# EAGLE design Thermostat_V1.0 (EAGLE 6.4)
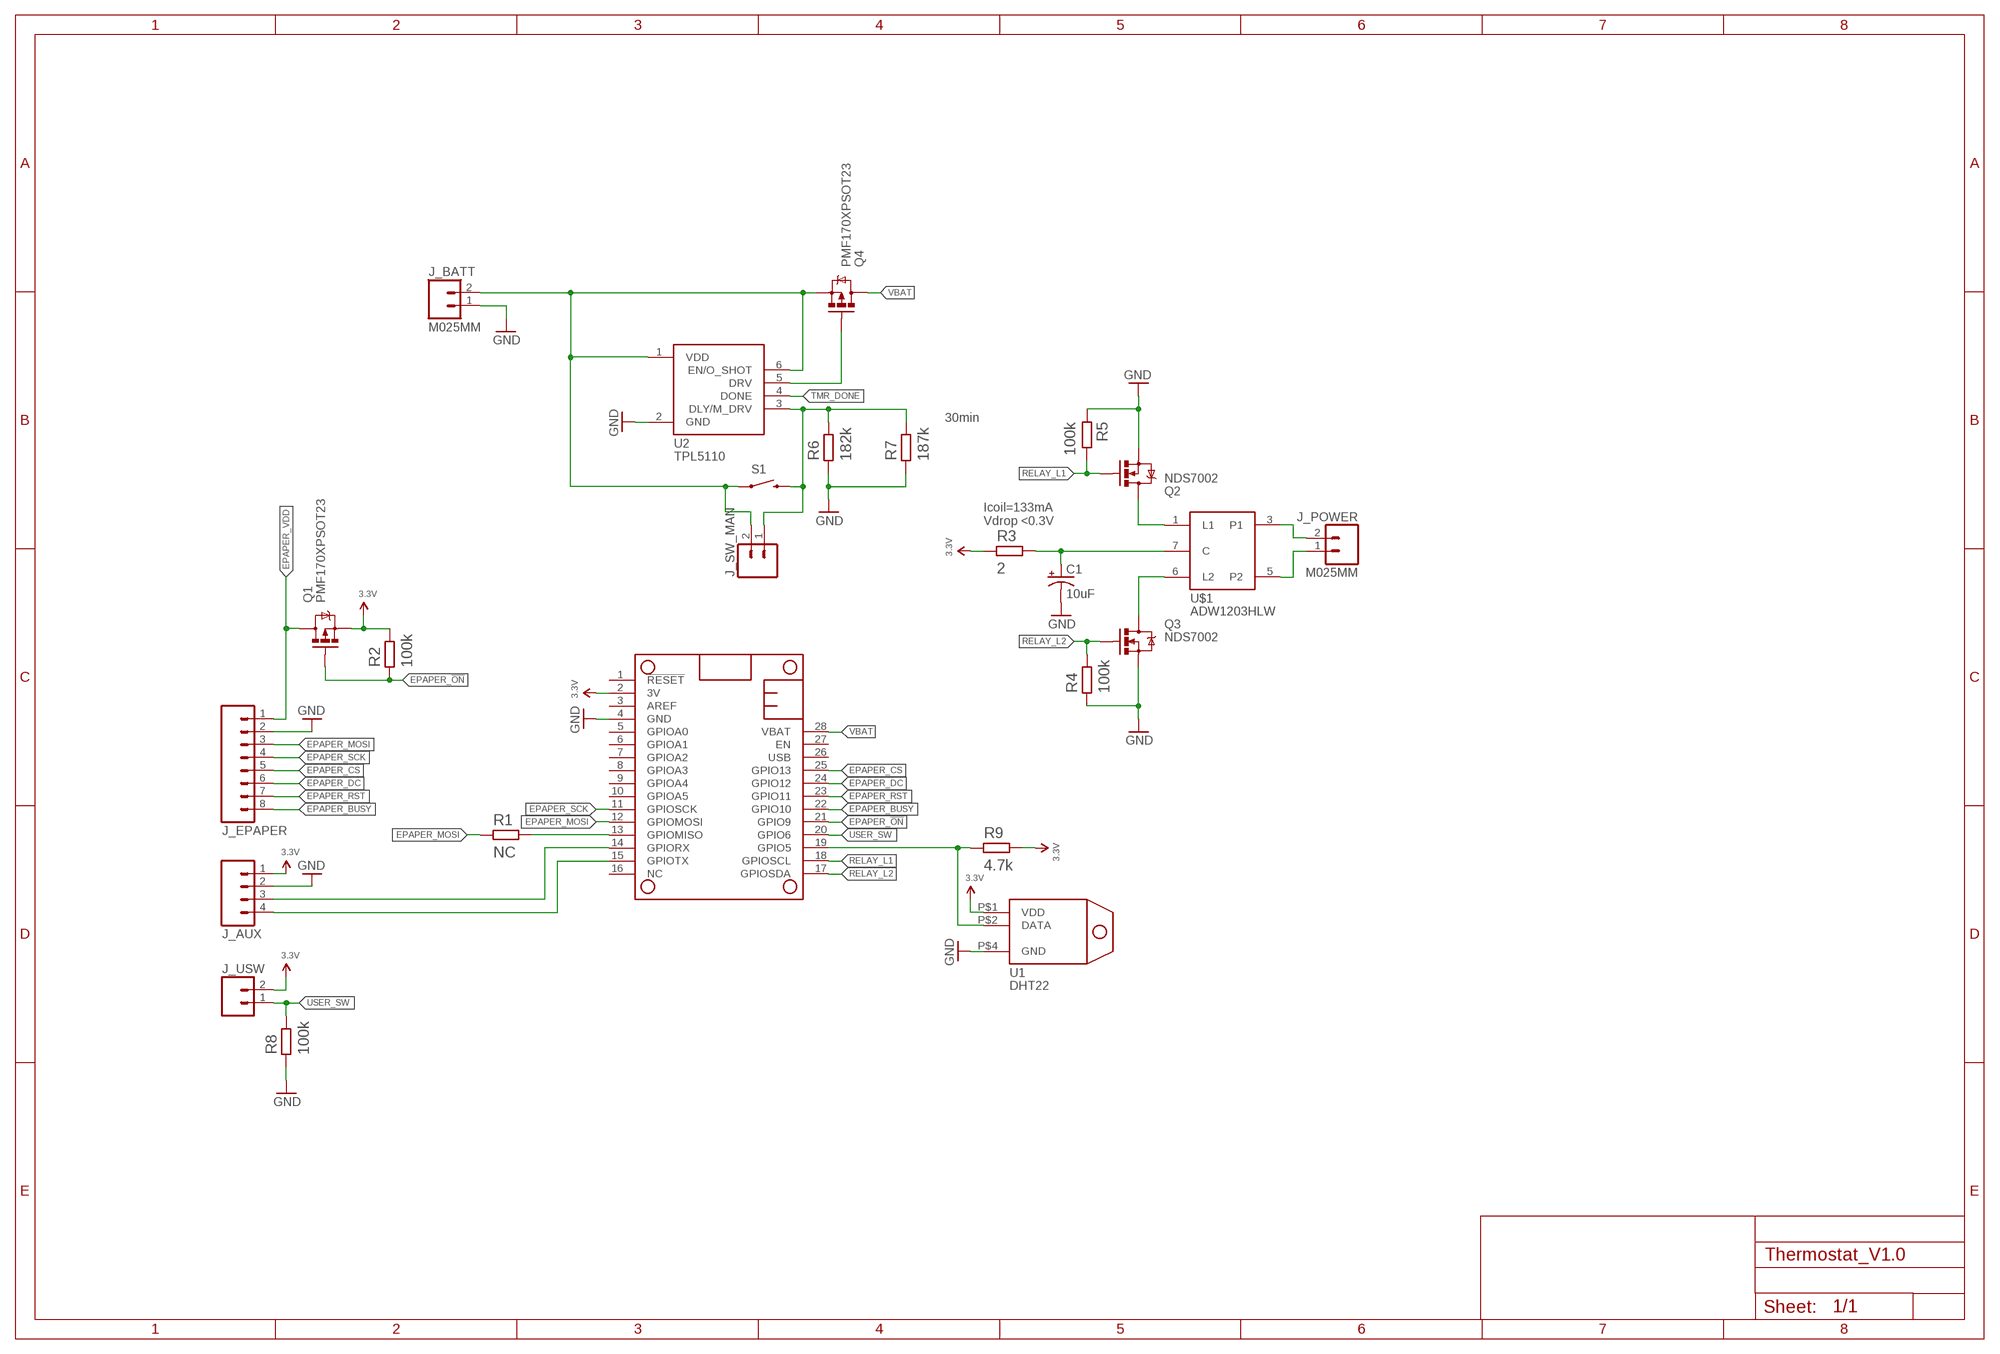
[diagram p0: schematic, sheet 1]

## Parts
C1  10uF  CAP_POLPTH1  [CPOL-RADIAL-100UF-25V]
J_AUX  M04LOCK  [1X04_LOCK]
J_BATT  M025MM  [SCREWTERMINAL-5MM-2]
J_EPAPER  M081X08  [1X08]
J_POWER  M025MM  [SCREWTERMINAL-5MM-2]
J_SW_MAN  M023.5MM-NO_SILK  [SCREWTERMINAL-3.5MM-2-NS]
J_USW  M023.5MM-NO_SILK  [SCREWTERMINAL-3.5MM-2-NS]
MS1  FEATHERWING  [FEATHERWING]
Q1  PMF170XPSOT23  [SOT23]
Q2  NDS7002  [SOT23]
Q3  NDS7002  [SOT23]
Q4  PMF170XPSOT23  [SOT23]
R1  NC  R0805  [R0805]
R2  100k  R0805  [R0805]
R3  2  R0805  [R0805]
R4  100k  R0805  [R0805]
R5  100k  R0805  [R0805]
R6  182k  R1210  [1210]
R7  187k  R1210  [1210]
R8  100k  R0805  [R0805]
R9  4.7k  R0805  [R0805]
S1  SWITCH-MOMENTARY-2SMD-4  [TACTILE_SWITCH_TALL]
U1  DHT22  [DHT22]
U2  TPL5110  [SOT23-6]
U$1  ADW1203HLW  [DW_RELAY]

## Nets
3.3V: J_AUX.1 J_USW.2 MS1.2(3V) Q1.2(S) R2.2 R3.1 R9.2 U1.P$1(VDD)
EPAPER_!ON: MS1.21(GPIO9) Q1.1(G) R2.1
EPAPER_BUSY: J_EPAPER.8 MS1.22(GPIO10)
EPAPER_CS: J_EPAPER.5 MS1.25(GPIO13)
EPAPER_DC: J_EPAPER.6 MS1.24(GPIO12)
EPAPER_MOSI: J_EPAPER.3 MS1.12(GPIOMOSI) R1.1
EPAPER_RST: J_EPAPER.7 MS1.23(GPIO11)
EPAPER_SCK: J_EPAPER.4 MS1.11(GPIOSCK)
EPAPER_VDD: J_EPAPER.1 Q1.3(D)
GND: C1.2(-) J_AUX.2 J_BATT.1 J_EPAPER.2 MS1.4(GND) Q2.2(S) Q3.2(S) R4.1 R5.1 R6.1 R7.1 R8.1 U1.P$4(GND) U2.2(GND)
N$1: J_POWER.2 U$1.3(P1)
N$2: J_POWER.1 U$1.5(P2)
N$3: MS1.19(GPIO5) R9.1 U1.P$2(DATA)
N$4: MS1.13(GPIOMISO) R1.2
N$5: C1.1(+) R3.2 U$1.7(C)
N$6: Q2.3(D) U$1.1(L1)
N$7: Q3.3(D) U$1.6(L2)
N$8: Q4.1(G) U2.5(DRV)
N$9: J_BATT.2 J_SW_MAN.2 Q4.2(S) S1.A2 U2.1(VDD) U2.6(EN/O_SHOT)
N$10: J_SW_MAN.1 R6.2 R7.2 S1.B2 U2.3(DLY/M_DRV)
N$11: J_AUX.3 MS1.14(GPIORX)
N$12: J_AUX.4 MS1.15(GPIOTX)
RELAY_L1: MS1.18(GPIOSCL) Q2.1(G) R5.2
RELAY_L2: MS1.17(GPIOSDA) Q3.1(G) R4.2
TMR_DONE: U2.4(DONE)
USER_SW: J_USW.1 MS1.20(GPIO6) R8.2
VBAT: MS1.28(VBAT) Q4.3(D)
Unconnected: MS1.1(!RESET) MS1.3(AREF) MS1.5(GPIOA0) MS1.6(GPIOA1) MS1.7(GPIOA2) MS1.8(GPIOA3) MS1.9(GPIOA4) MS1.10(GPIOA5) MS1.16(NC) MS1.26(USB) MS1.27(EN)

## Notes on the sheet
- 30min
- Icoil=133mA
  Vdrop <0.3V

## Library data of the parts
C1 = SparkFun-Capacitors:CAP_POL: Capacitor Polarized These are standard SMD and PTH capacitors. Normally 10uF, 47uF, and 100uF in electrolytic and tantalum varieties. Always verify the external diameter of the through hole cap, it varies with capacity, voltage, and manufacturer. The EIA devices should be standard.
J_AUX = 0SBLib:M04: Header 4 Standard 4-pin 0.1" header. Use with straight break away headers (SKU : PRT-00116), right angle break away headers (PRT-00553), swiss pins (PRT-00743), machine pins (PRT-00117), and female headers (PRT-00115). Molex polarized connector foot print use with SKU : PRT-08231 with associated crimp pins and housings. 1MM SMD Version SKU: PRT-10208
J_BATT J_POWER = SparkFun-Connectors:M02: Standard 2-pin 0.1" header. Use with - straight break away headers ( PRT-00116) - right angle break away headers (PRT-00553) - swiss pins (PRT-00743) - machine pins (PRT-00117) - female headers (PRT-00115) Molex polarized connector foot print use with: PRT-08233 with associated crimp pins and housings. 2.54_SCREWTERM for use with PRT-10571. 3.5mm Screw Terminal footprints for PRT-08084 5mm Screw Terminal footprints for use with PRT-08432; STOREFRONT_ID: PRT-08432
J_EPAPER = SparkFun-Connectors:M08: Header 8 Standard 8-pin 0.1" header. Use with straight break away headers (SKU : PRT-00116), right angle break away headers (PRT-00553), swiss pins (PRT-00743), machine pins (PRT-00117), and female headers (PRT-00115).
J_SW_MAN J_USW = SparkFun-Connectors:M02: Standard 2-pin 0.1" header. Use with - straight break away headers ( PRT-00116) - right angle break away headers (PRT-00553) - swiss pins (PRT-00743) - machine pins (PRT-00117) - female headers (PRT-00115) Molex polarized connector foot print use with: PRT-08233 with associated crimp pins and housings. 2.54_SCREWTERM for use with PRT-10571. 3.5mm Screw Terminal footprints for PRT-08084 5mm Screw Terminal footprints for use with PRT-08432
MS1 = adafruit:FEATHERWING
Q1 Q4 = 0SBLib:PMF170XP
Q2 Q3 = 0SBLib:NDS7002
R1-R9 = 0SBLib:R
S1 = SparkFun-Electromechanical:SWITCH-MOMENTARY-2: Various NO switches- pushbuttons, reed, etc; PROD_ID: SWCH-11966
U1 = 0SBLib:DHT22
U2 = 0SBLib:TPL5110
U$1 = 0SBLib:ADW1203HLW

## Board
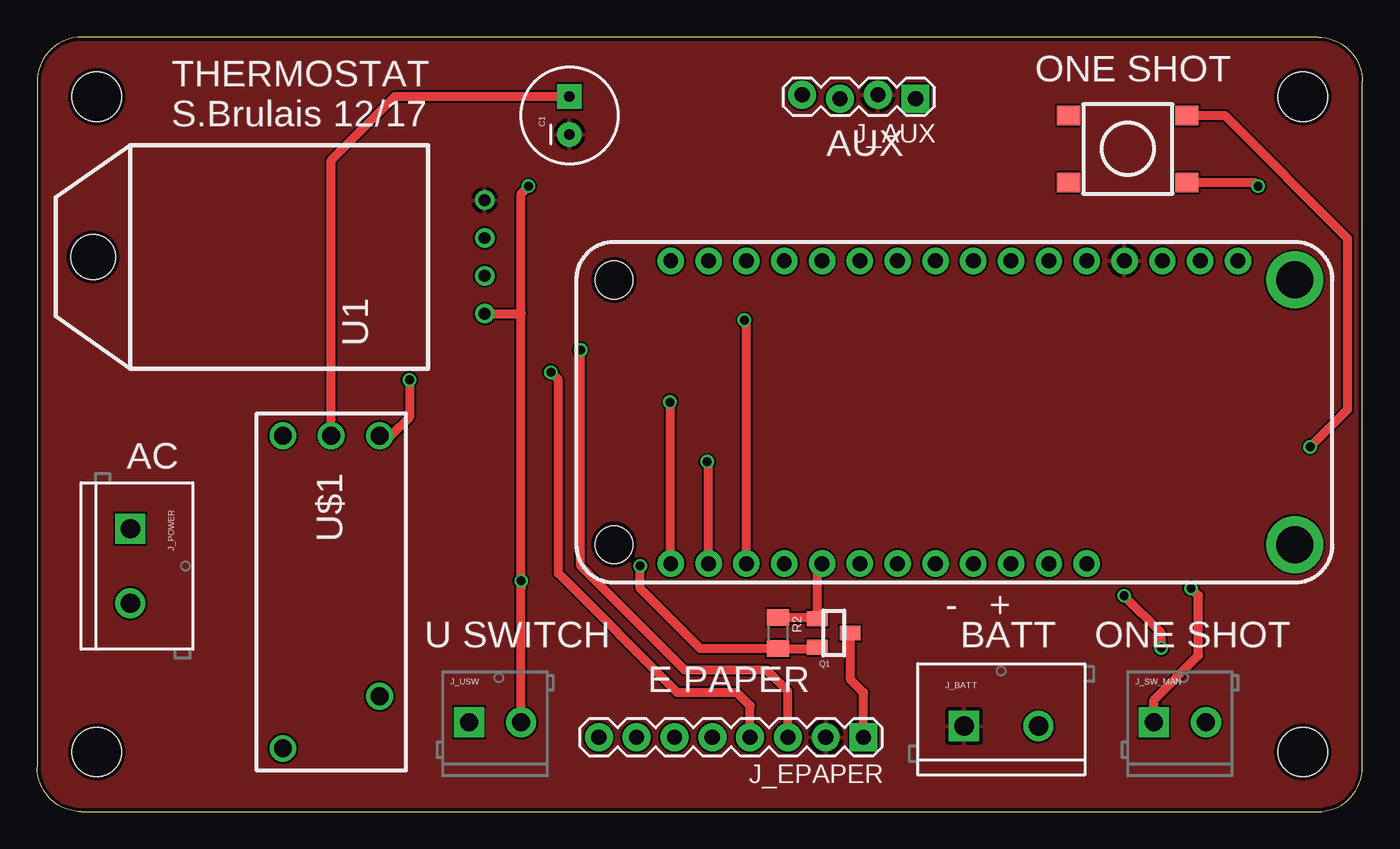
[diagram p1: board, top side]
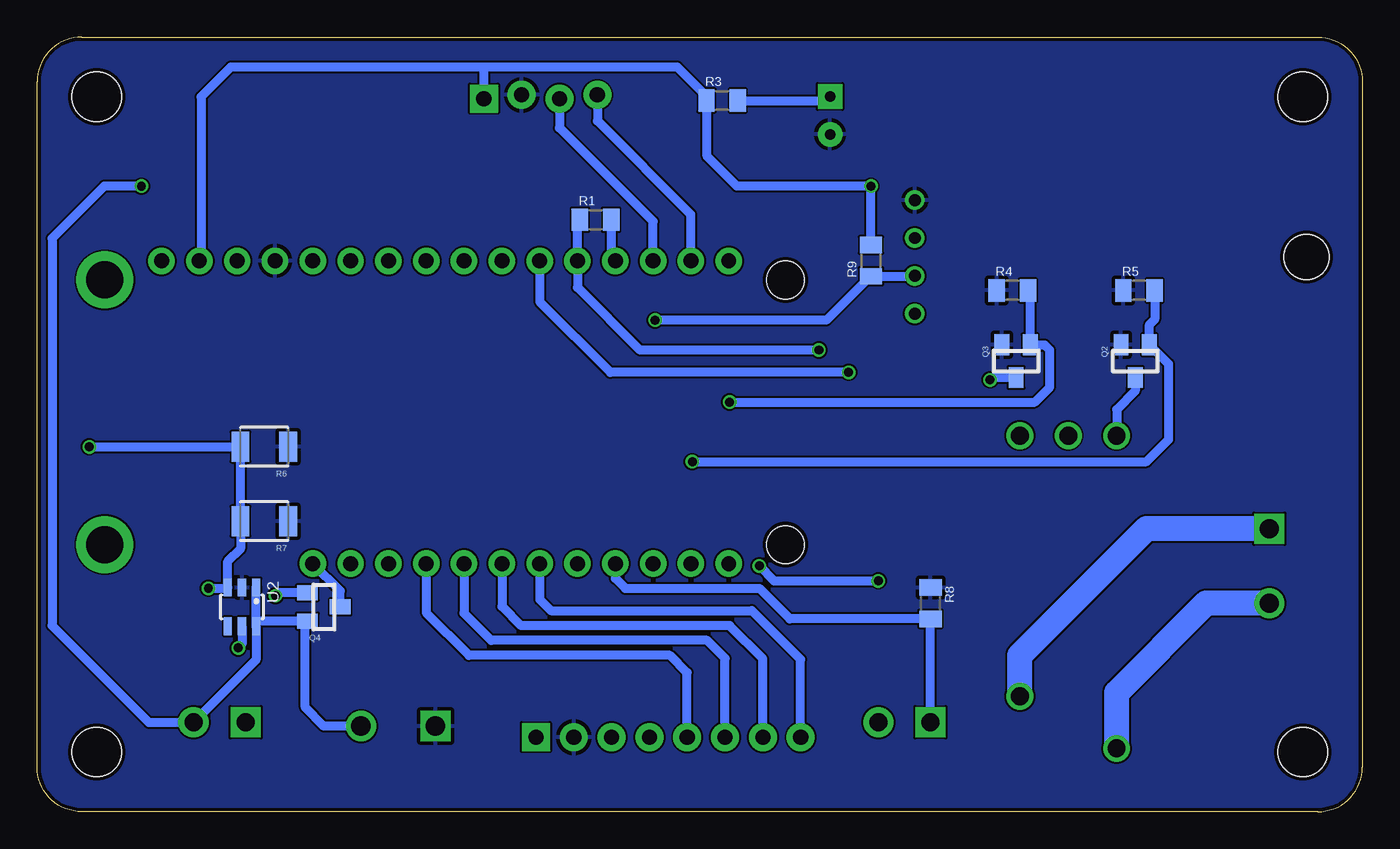
[diagram p2: board, bottom side, seen from below]

Size 89 x 52 mm. Coordinates in mm from the lower left corner, seen from the top.
Outline: 3,0 86,0 arc90 89,3 89,49 arc90 86,52 3,52 arc90 0,49 0,3 arc90 3,0
Copper layers (1*16): Top 0.035mm / dielectric 1.5mm / Bottom 0.035mm
Design rules "dirt_cheap_dirty_boards.v1": minimum track width 5mil, minimum drill 12mil, track to track 5mil, track to pad 5mil, pad to pad 5mil, via to via 5mil, smd to smd 0mil, copper to edge 10mil, drill to drill 10mil, minimum pad ring 10mil, minimum via ring 6mil, stop-mask expansion 2mil, vias tented up to drill 25mil, thermal gap 10mil
Holes 3.3 mm at 4,4 85,4 4,48 85,48

### Footprints (pad centres in the part's own frame; a part is rotated, then mirrored left to right if it is on the bottom)
CPOL-RADIAL-100UF-25V = drill 0.7 pad 1.651 square: 1 1.27,0 | drill 0.7 pad 1.651: 2 -1.27,0
1X04_LOCK = drill 1.016 pad 1.88 square: 1 0,0.127 | drill 1.016 pad 1.88: 2 2.54,-0.127; 3 5.08,0.127; 4 7.62,-0.127
SCREWTERMINAL-5MM-2 = drill 1.3 pad 2.032 square: 1 0,0 | drill 1.3 pad 2.032: 2 5,0
1X08 = drill 1.016 pad 1.88 square: 1 0,0 | drill 1.016 pad 1.88: 2 2.54,0; 3 5.08,0; 4 7.62,0; 5 10.16,0; 6 12.7,0; 7 15.24,0; 8 17.78,0
SCREWTERMINAL-3.5MM-2-NS = drill 1.2 pad 2.032 square: 1 0,0 | drill 1.2 pad 2.032: 2 3.5,0
FEATHERWING = drill 1 pad 1.778: 1 6.35,1.27; 2 8.89,1.27; 3 11.43,1.27; 4 13.97,1.27; 5 16.51,1.27; 6 19.05,1.27; 7 21.59,1.27; 8 24.13,1.27; 9 26.67,1.27; 10 29.21,1.27; 11 31.75,1.27; 12 34.29,1.27; 13 36.83,1.27; 14 39.37,1.27; 15 41.91,1.27; 16 44.45,1.27; 17 44.45,21.59; 18 41.91,21.59; 19 39.37,21.59; 20 36.83,21.59; 21 34.29,21.59; 22 31.75,21.59; 23 29.21,21.59; 24 26.67,21.59; 25 24.13,21.59; 26 21.59,21.59; 27 19.05,21.59; 28 16.51,21.59 | drill 2.5 pad 3.81: P$1 2.54,20.32; P$2 2.54,2.54 | hole 2.54: 48.26,20.32; 48.26,2.54
SOT23 = smd 1 x 1.4: 1 -0.95,-1.1; 2 0.95,-1.1; 3 0,1.1
R0805 = smd 1.1 x 1.5: 1 -1.05,0; 2 1.05,0
1210 = smd 1.2 x 2: 1 -1.6,0; 2 1.6,0
TACTILE_SWITCH_TALL = smd 1.55 x 1.3: A1 -3.975,-2.25; A2 3.975,-2.25; B1 -3.975,2.25; B2 3.975,2.25
DHT22 = drill 0.8: P$1 -3.81,-3.81; P$2 -1.27,-3.81; P$3 1.27,-3.81; P$4 3.81,-3.81 | hole 3: 0,22.5
SOT23-6 = smd 0.55 x 1.2: 1 -0.95,-1.3; 2 0,-1.3; 3 0.95,-1.3; 4 0.95,1.3; 5 0,1.3; 6 -0.95,1.3
DW_RELAY = drill 1.2: 1 -10.5,-3.25; 3 10.5,-3.25; 5 7,3.25; 6 -10.5,3.25; 7 -10.5,0

### Placement (x,y rotation side)
C1  35.75,46.75 90 top
J_AUX  59,48 180 top
J_BATT  62.25,5.75 0 top
J_EPAPER  55.5,5 180 top
J_POWER  6.25,19 270 top
J_SW_MAN  75,6 0 top
J_USW  29,6 0 top
MS1  87,38.25 180 top
Q1  53.5,12 270 top
Q2  15.25,30.25 180 bottom
Q3  23.25,30.25 180 bottom
Q4  69.75,13.75 270 bottom
R1  51.5,39.75 0 bottom
R2  49.75,12 270 top
R3  43,47.75 0 bottom
R4  23.5,35 0 bottom
R5  15,35 0 bottom
R6  73.75,24.5 180 bottom
R7  73.75,19.5 180 bottom
R8  29,14 270 bottom
R9  33,37 90 bottom
S1  73.25,44.5 0 top
U1  26.25,37.25 90 top
U2  75.25,13.75 180 bottom
U$1  19.75,14.75 270 top

### Tracks (layer width: path | path; a pad name or v marks a point on that pad's centre or on a via)
3.3V  (via drill 0.6)
  Top 0.61: J_USW.2 v32.5,15.5 | v32.5,15.5 32.5,33.5 | 32.5,33.5 32.5,41.5 v33,42 | U1.P$1 32.44,33.44 32.5,33.5 | Q1.2 52.3,10.95 R2.2 44.55,10.95 40.5,15 v40.5,16.5 | v32.5,15.5 32.5,15
  Bottom 0.61: 59,50 46,50 44.05,48.05 R3.1 44,47.7 44,44 42,42 v33,42 R9.2 | 59,50 76,50 78,48 78,37.09 MS1.2 | J_AUX.1 59,50 | v40.5,16.5 39.5,15.5 v32.5,15.5
EPAPER_!ON
  Top 0.61: MS1.21 52.4,16.35 Q1.1 52.3,13.05 R2.1
EPAPER_BUSY
  Bottom 0.61: MS1.22 55.25,14.25 54.5,13.5 41,13.5 37.72,10.22 J_EPAPER.8
EPAPER_CS
  Bottom 0.61: J_EPAPER.5 45.34,9.34 46.5,10.5 60,10.5 62.87,13.37 MS1.25
EPAPER_DC
  Bottom 0.61: J_EPAPER.6 42.8,10.3 44,11.5 58.5,11.5 60.33,13.33 MS1.24
EPAPER_MOSI  (via drill 0.6)
  Top 0.61: J_EPAPER.3 50.42,8.08 49,9.5 43.5,9.5 36.5,16.5 v36.5,31
  Bottom 0.61: v36.5,31 48.5,31 52.71,35.21 MS1.12 52.71,39.59 R1.1
EPAPER_RST
  Bottom 0.61: J_EPAPER.7 40.26,10.26 42.5,12.5 56.5,12.5 57.79,13.79 MS1.23
EPAPER_SCK  (via drill 0.6)
  Top 0.61: J_EPAPER.4 47.88,7.12 47,8 43,8 35,16 35,29 v34.5,29.5
  Bottom 0.61: v34.5,29.5 50.5,29.5 55.25,34.25 MS1.11
EPAPER_VDD
  Top 0.61: J_EPAPER.1 55.5,8 54.6,8.9 Q1.3
GND
  pour Bottom: 0,52 89,52 89,0 0,0
  pour Top: 0,52 89,52 89,0 0,0
N$1
  Bottom 1.676: U$1.3 16.5,8 10.5,14 J_POWER.2
N$2
  Bottom 1.676: U$1.5 23,10.5 14.5,19 J_POWER.1
N$3  (via drill 0.6)
  Top 0.61: MS1.19 47.63,32.87 v47.5,33
  Bottom 0.61: U1.P$2 30.09,35.95 R9.1 33.05,35.95 36,33 v47.5,33
N$4
  Bottom 0.61: R1.2 50.45,37.26 MS1.13
N$5
  Top 0.61: C1.1 24.02,48.02 19.75,43.75 U$1.7
  Bottom 0.61: R3.2 36.02,47.75 C1.1
N$6
  Bottom 0.61: Q2.3 15.25,28.25 16.5,27 U$1.1
N$7  (via drill 0.6)
  Top 0.61: v25,29 25,26.5 23.75,25.25 U$1.6
  Bottom 0.61: Q3.3 24.85,29.15 v25,29
N$8  (via drill 0.6)
  Top 0.61: v75.5,11 75.5,12 v73,14.5
  Bottom 0.61: U2.5 75.25,11.25 v75.5,11 | Q4.1 72.8,14.7 v73,14.5
N$9  (via drill 0.6)
  Top 0.61: S1.A2 81.75,42.25 v82,42
  Bottom 0.61: v82,42 84.5,42 88,38.5 88,12.5 81.5,6 J_SW_MAN.2 74.3,10.2 U2.6 74.3,13 | 74.3,13 U2.1 | 74.3,13 74.1,12.8 Q4.2 71,12.65 71,7 69.75,5.75 J_BATT.2
N$10  (via drill 0.6)
  Top 0.61: S1.B2 79.75,46.75 88,38.5 88,27 v85.5,24.5 | J_SW_MAN.1 75,7.5 78,10.5 78,14.5 v77.5,15
  Bottom 0.61: v85.5,24.5 R6.2 R7.2 75.35,17.65 76.2,16.8 U2.3 76.25,15 v77.5,15
N$11
  Bottom 0.61: MS1.14 47.63,39.63 53.92,45.92 J_AUX.3
N$12
  Bottom 0.61: MS1.15 45.09,40.09 51.38,46.38 J_AUX.4
RELAY_L1  (via drill 0.6)
  Top 0.61: MS1.18 45.09,23.41 v45,23.5
  Bottom 0.61: v45,23.5 14.5,23.5 13,25 13,30.05 Q2.1 14.3,32.7 13.95,33.05 R5.2
RELAY_L2  (via drill 0.6)
  Top 0.61: MS1.17 42.55,27.45 v42.5,27.5
  Bottom 0.61: v42.5,27.5 22,27.5 21,28.5 21,31 21.35,31.35 Q3.1 22.3,34.85 R4.2
USER_SW
  Bottom 0.61: J_USW.1 R8.2 38.45,12.95 40.5,15 49.5,15 50.17,15.67 MS1.20
VBAT
  Bottom 0.61: Q4.3 68.65,14.82 MS1.28

### Text on the board
tPlace: ONE SHOT | THERMOSTAT / S.Brulais 12/17 | AUX | AC | - + | U SWITCH | BATT | ONE SHOT | E PAPER